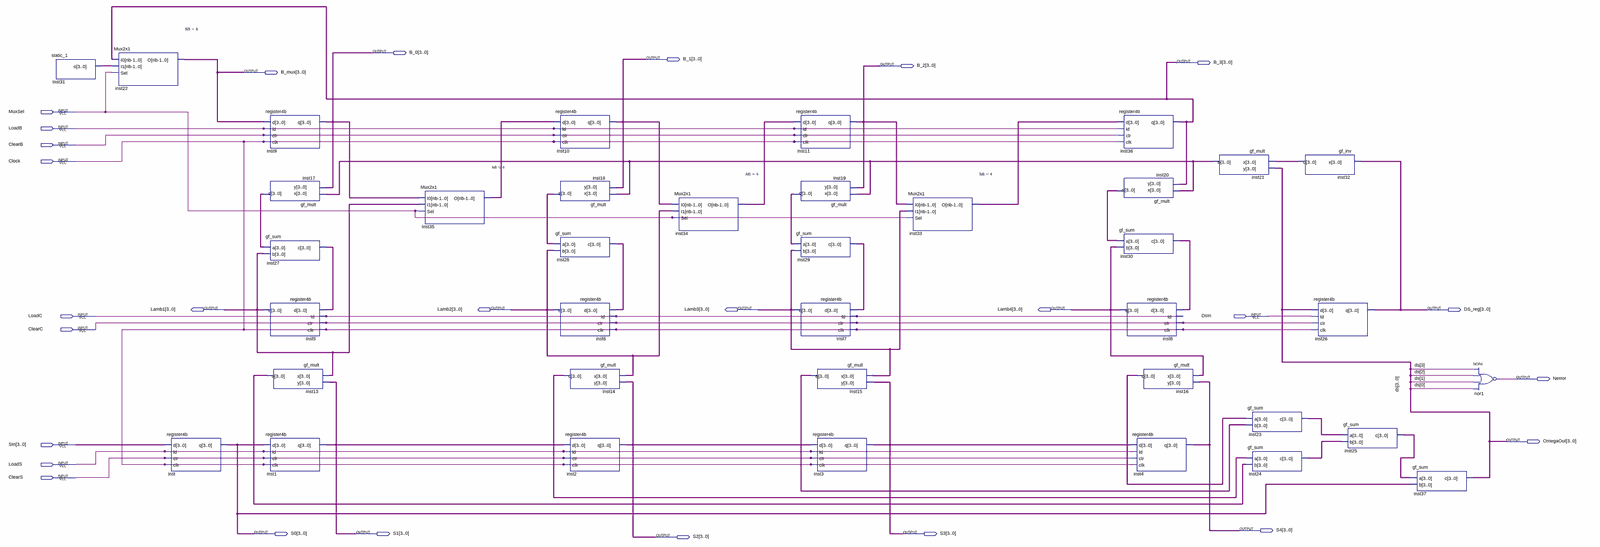
[diagram p0: schematic sheet, whole]
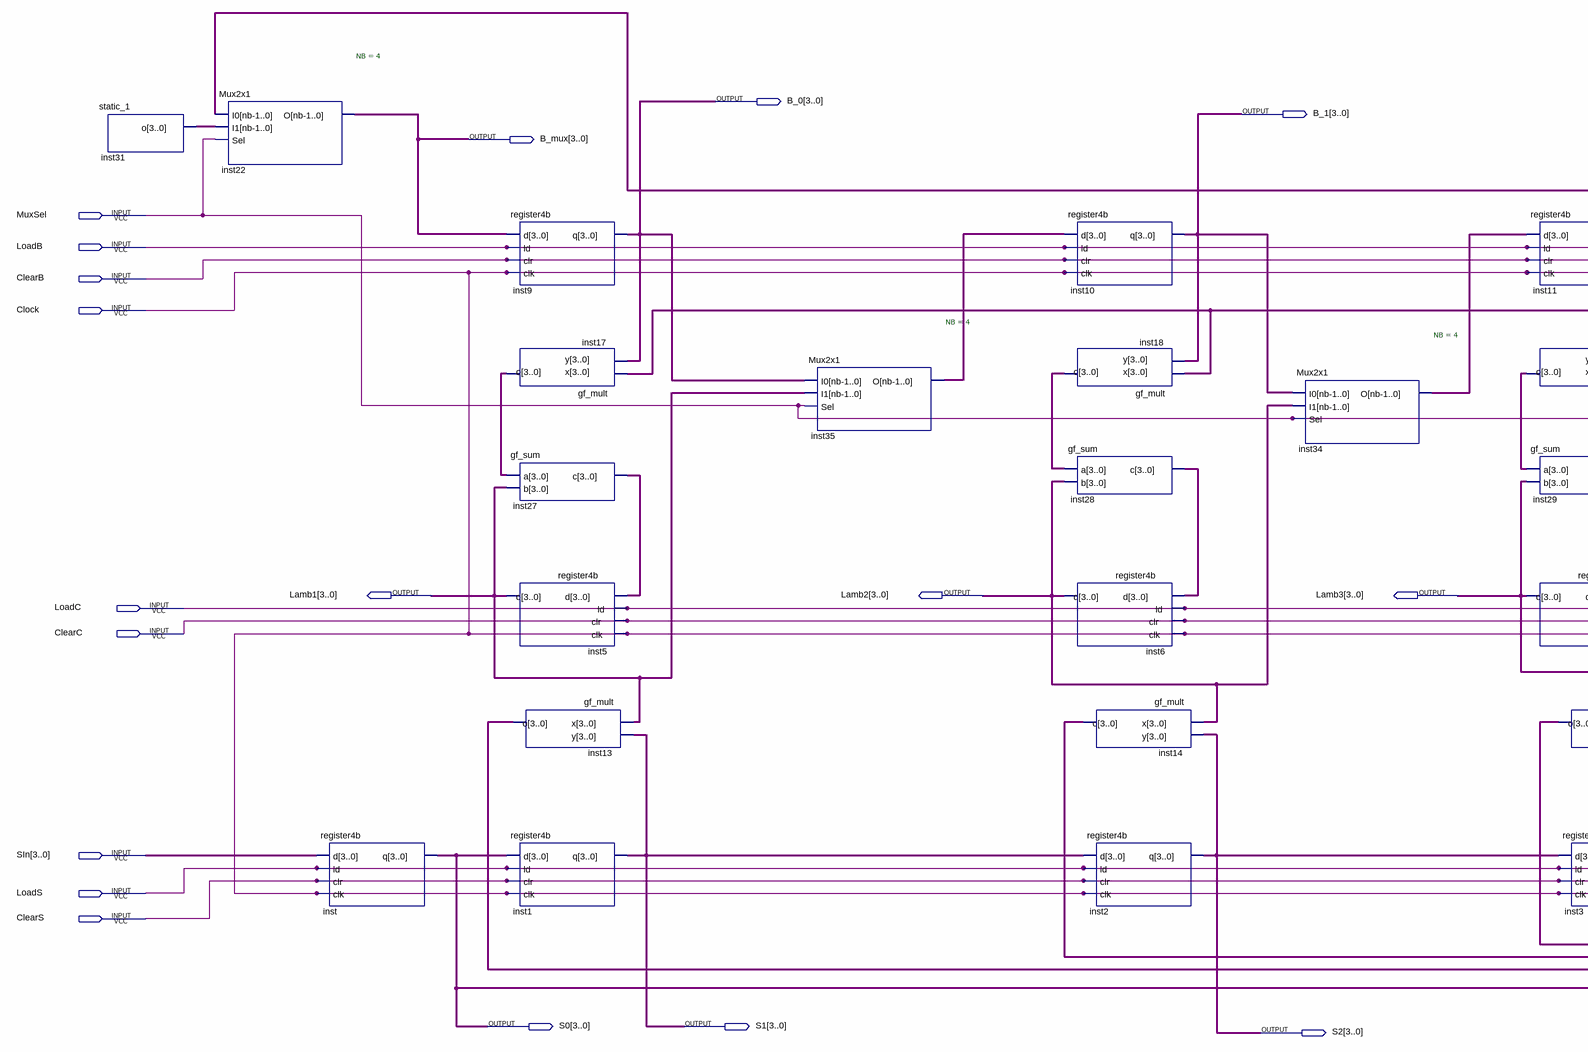
[diagram p1: schematic sheet, left part]
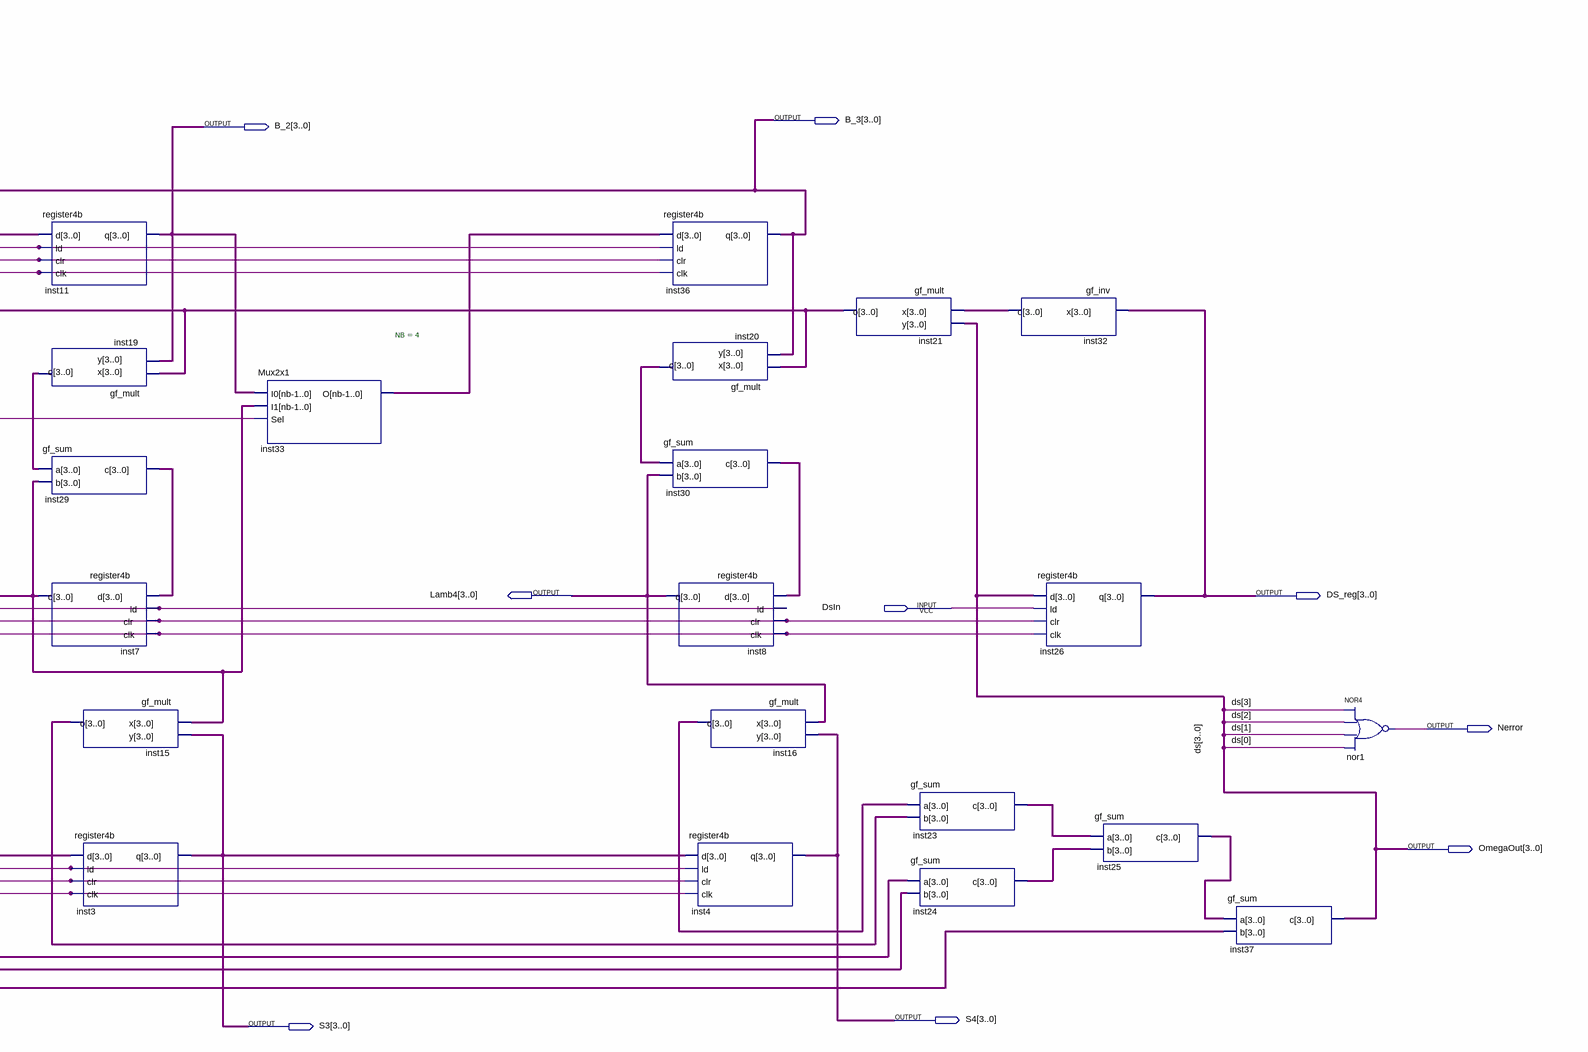
[diagram p2: schematic sheet, right part]
// Quartus schematic Berlekamp_Massey.bdf as structural Verilog: 38 symbols, 27 pins
module Berlekamp_Massey (
  input  MuxSel,
  input  LoadB,
  input  ClearB,
  input  Clock,
  input  LoadC,
  input  DsIn,
  input  ClearC,
  input  [3:0] SIn,
  input  LoadS,
  input  ClearS,
  output [3:0] B_0,
  output [3:0] B_1,
  output [3:0] B_3,
  output [3:0] B_2,
  output [3:0] B_mux,
  output [3:0] Lamb1,
  output [3:0] Lamb2,
  output [3:0] Lamb3,
  output [3:0] Lamb4,
  output [3:0] DS_reg,
  output Nerror,
  output [3:0] OmegaOut,
  output [3:0] S4,
  output [3:0] S0,
  output [3:0] S1,
  output [3:0] S3,
  output [3:0] S2
);

  wire [3:0] inst13_o, inst14_o, inst15_o, inst16_o, inst17_o, inst18_o, inst19_o, inst20_o, inst21_o,
       inst23_c, inst24_c, inst25_c, inst27_c, inst28_c, inst29_c, inst30_c, inst31_o, inst32_o, inst33_o,
       inst34_o, inst35_o;

  static_1 inst31 (.o(inst31_o));
  Mux2x1 #(.NB(4)) inst22 (.I0(B_3), .I1(inst31_o), .Sel(MuxSel), .O(B_mux));
  register4b inst (.d(SIn), .ld(LoadS), .clr(ClearS), .clk(Clock), .q(S0));
  register4b inst9 (.d(B_mux), .ld(LoadB), .clr(ClearB), .clk(Clock), .q(B_0));
  gf_mult inst17 (.x(inst21_o), .y(B_0), .o(inst17_o));
  gf_sum inst27 (.a(inst17_o), .b(Lamb1), .c(inst27_c));
  register4b inst5 (.d(inst27_c), .ld(LoadC), .clr(ClearC), .clk(Clock), .q(Lamb1));
  gf_mult inst13 (.x(Lamb1), .y(S1), .o(inst13_o));
  register4b inst1 (.d(S0), .ld(LoadS), .clr(ClearS), .clk(Clock), .q(S1));
  Mux2x1 #(.NB(4)) inst35 (.I0(B_0), .I1(Lamb1), .Sel(MuxSel), .O(inst35_o));
  register4b inst10 (.d(inst35_o), .ld(LoadB), .clr(ClearB), .clk(Clock), .q(B_1));
  gf_mult inst18 (.x(inst21_o), .y(B_1), .o(inst18_o));
  gf_sum inst28 (.a(inst18_o), .b(Lamb2), .c(inst28_c));
  register4b inst6 (.d(inst28_c), .ld(LoadC), .clr(ClearC), .clk(Clock), .q(Lamb2));
  gf_mult inst14 (.x(Lamb2), .y(S2), .o(inst14_o));
  register4b inst2 (.d(S1), .ld(LoadS), .clr(ClearS), .clk(Clock), .q(S2));
  Mux2x1 #(.NB(4)) inst34 (.I0(B_1), .I1(Lamb2), .Sel(MuxSel), .O(inst34_o));
  register4b inst11 (.d(inst34_o), .ld(LoadB), .clr(ClearB), .clk(Clock), .q(B_2));
  gf_mult inst19 (.x(inst21_o), .y(B_2), .o(inst19_o));
  gf_sum inst29 (.a(inst19_o), .b(Lamb3), .c(inst29_c));
  register4b inst7 (.d(inst29_c), .ld(LoadC), .clr(ClearC), .clk(Clock), .q(Lamb3));
  gf_mult inst15 (.x(Lamb3), .y(S3), .o(inst15_o));
  register4b inst3 (.d(S2), .ld(LoadS), .clr(ClearS), .clk(Clock), .q(S3));
  Mux2x1 #(.NB(4)) inst33 (.I0(B_2), .I1(Lamb3), .Sel(MuxSel), .O(inst33_o));
  register4b inst36 (.d(inst33_o), .ld(LoadB), .clr(ClearB), .clk(Clock), .q(B_3));
  gf_mult inst20 (.x(inst21_o), .y(B_3), .o(inst20_o));
  gf_sum inst30 (.a(inst20_o), .b(Lamb4), .c(inst30_c));
  register4b inst8 (.d(inst30_c), .ld(LoadC), .clr(ClearC), .clk(Clock), .q(Lamb4));
  gf_mult inst16 (.x(Lamb4), .y(S4), .o(inst16_o));
  register4b inst4 (.d(S3), .ld(LoadS), .clr(ClearS), .clk(Clock), .q(S4));
  gf_mult inst21 (.x(inst32_o), .y(OmegaOut), .o(inst21_o));
  gf_sum inst23 (.a(inst16_o), .b(inst15_o), .c(inst23_c));
  gf_sum inst24 (.a(inst14_o), .b(inst13_o), .c(inst24_c));
  gf_inv inst32 (.x(DS_reg), .o(inst32_o));
  register4b inst26 (.d(OmegaOut), .ld(DsIn), .clr(ClearC), .clk(Clock), .q(DS_reg));
  gf_sum inst25 (.a(inst23_c), .b(inst24_c), .c(inst25_c));
  gf_sum inst37 (.a(inst25_c), .b(S0), .c(OmegaOut));
  nor nor1 (Nerror, OmegaOut[3], OmegaOut[2], OmegaOut[1], OmegaOut[0]);

  // Other names for the same wires on the sheet: ds[3:0] = OmegaOut
endmodule
